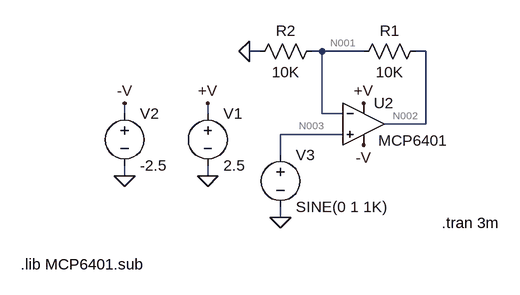
[diagram p0: schematic opamp-test.asc]
opamp-test.asc, the LTspice schematic file:
Version 4
SHEET 1 896 680
WIRE -48 -16 -64 -16
WIRE 48 -16 32 -16
WIRE 112 -16 48 -16
WIRE 208 -16 192 -16
WIRE -256 80 -256 64
WIRE -128 80 -128 64
WIRE 48 80 48 -16
WIRE 80 80 48 80
WIRE 208 96 208 -16
WIRE 208 96 144 96
WIRE 80 112 -16 112
WIRE -16 144 -16 112
WIRE -256 176 -256 160
WIRE -128 176 -128 160
WIRE -16 240 -16 224
FLAG -128 176 0
FLAG 112 64 +V
FLAG -128 64 +V
FLAG 112 128 -V
FLAG -256 176 0
FLAG -256 64 -V
FLAG -16 240 0
FLAG -64 -16 0
SYMBOL voltage -128 64 R0
SYMATTR InstName V1
SYMATTR Value 2.5
SYMBOL voltage -256 64 R0
SYMATTR InstName V2
SYMATTR Value -2.5
SYMBOL voltage -16 128 R0
SYMATTR InstName V3
SYMATTR Value SINE(0 1 1K)
SYMBOL res 208 -32 R90
WINDOW 0 0 56 VBottom 2
WINDOW 3 32 56 VTop 2
SYMATTR InstName R1
SYMATTR Value 10K
SYMBOL res 48 -32 R90
WINDOW 0 0 56 VBottom 2
WINDOW 3 32 56 VTop 2
SYMATTR InstName R2
SYMATTR Value 10K
SYMBOL Opamps\\UniversalOpamp2 112 96 R0
WINDOW 3 23 25 Left 2
SYMATTR InstName U2
SYMATTR SpiceModel ""
SYMATTR Value2 ""
SYMATTR SpiceLine ""
SYMATTR SpiceLine2 ""
SYMATTR Value MCP6401
TEXT 232 248 Left 2 !.tran 3m
TEXT -416 312 Left 2 !.lib MCP6401.sub

The netlist it stands for:
* opamp-test.asc
V1 +V 0 2.5
V2 -V 0 -2.5
V3 N003 0 SINE(0 1 1K)
R1 N002 N001 10K
R2 N001 0 10K
XU2 N003 N001 +V -V N002 MCP6401  ; pins IN+ IN- V+ V- OUT
.tran 3m
.lib MCP6401.sub
.lib UniversalOpamps2.sub
.backanno
.end

* Results of the author's LTspice run, read from the files saved beside the schematic
* Operating Point, zero values left out:
*   V(+v) = 2.5 V
*   V(-v) = -2.5 V
*   V(n002) = -7.413 mV
*   V(n001) = -3.706 mV
*   I(R2) = -370.6 nA
*   I(R1) = -370.6 nA
*   I(V3) = -2.227 pA
*   I(V2) = 46.37 µA
*   I(V1) = -46 µA
*   Ix(u2:1) = 2.227 pA
*   Ix(u2:3) = 46 µA
*   Ix(u2:4) = -46.37 µA
*   Ix(u2:5) = 370.6 nA
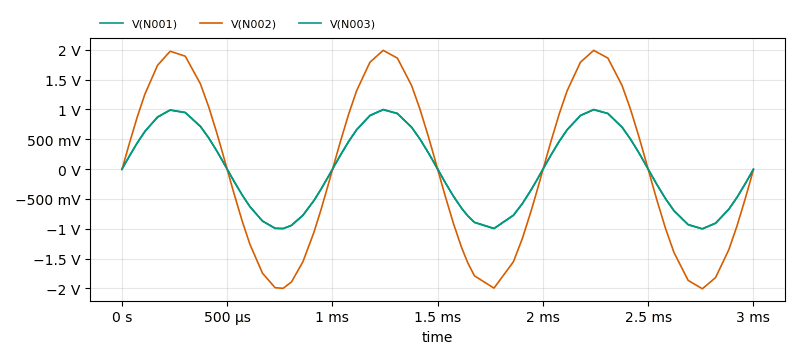
[diagram p1: Transient Analysis of opamp-test.asc, plotted from the saved traces]
* Transient Analysis, 1 run:
*   V(N001): min -1.003 V, max 994.5 mV, average -3.523 mV, rms 701.4 mV, last -5.789 mV
*   V(N002): min -2.005 V, max 1.989 V, average -7.046 mV, rms 1.403 V, last -11.2 mV
*   V(N003): min -998.9 mV, max 998.4 mV, average 182.9 µV, rms 701.4 mV, last 0 V